# Altium schematic sheet SCH-6.SchDoc
size A4; Date: 05.05.2020; Organization: Günsel Model 1 Body Harness; Revision: v0.1
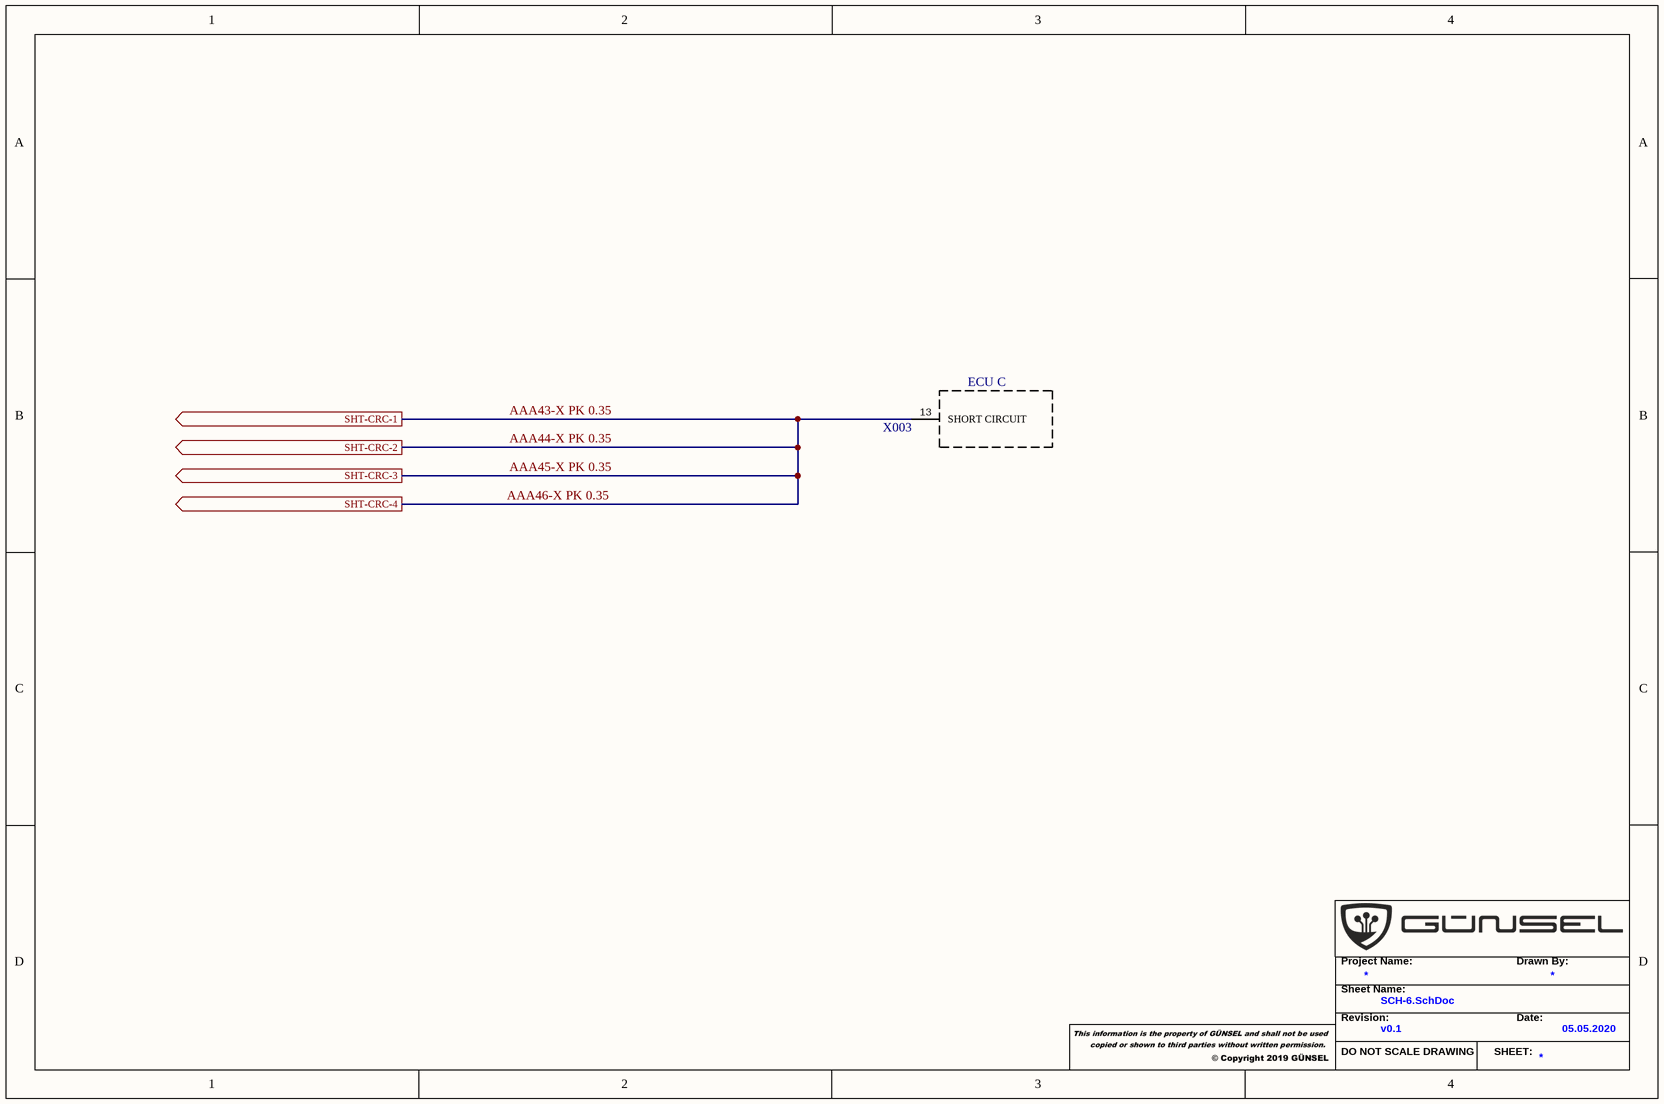
[diagram p0: SCH-6.SchDoc]

## Parts
X31  X003

## Blocks framed on the sheet
ECU C: X31

## Ports
SHT-CRC-1 (out), SHT-CRC-2 (out), SHT-CRC-3 (out), SHT-CRC-4 (out)

## Nets
AAA43-X PK 0.35: X31.13(SHORT_CIRCUIT) ; port SHT-CRC-1, port SHT-CRC-2, port SHT-CRC-3, port SHT-CRC-4  [also labelled AAA44-X PK 0.35, AAA45-X PK 0.35, AAA46-X PK 0.35]

Not connected (* = marked no-connect by the designer): X31 1 2 3 4 5 6 7 8 9 10 11 12 14 15 16 17 18 19 20

## Notes on the sheet
- Project Name:
- Drawn By:
- Sheet Name:
- Revision:
- DO NOT SCALE DRAWING
- SHEET:
- Date:

## Library data of the parts
X31 = ECU C: Description: ECU C; Designator_: X003; Pin count: 20; Manufacturer Part number: E-3